# Altium project DashBoard.PrjPCB
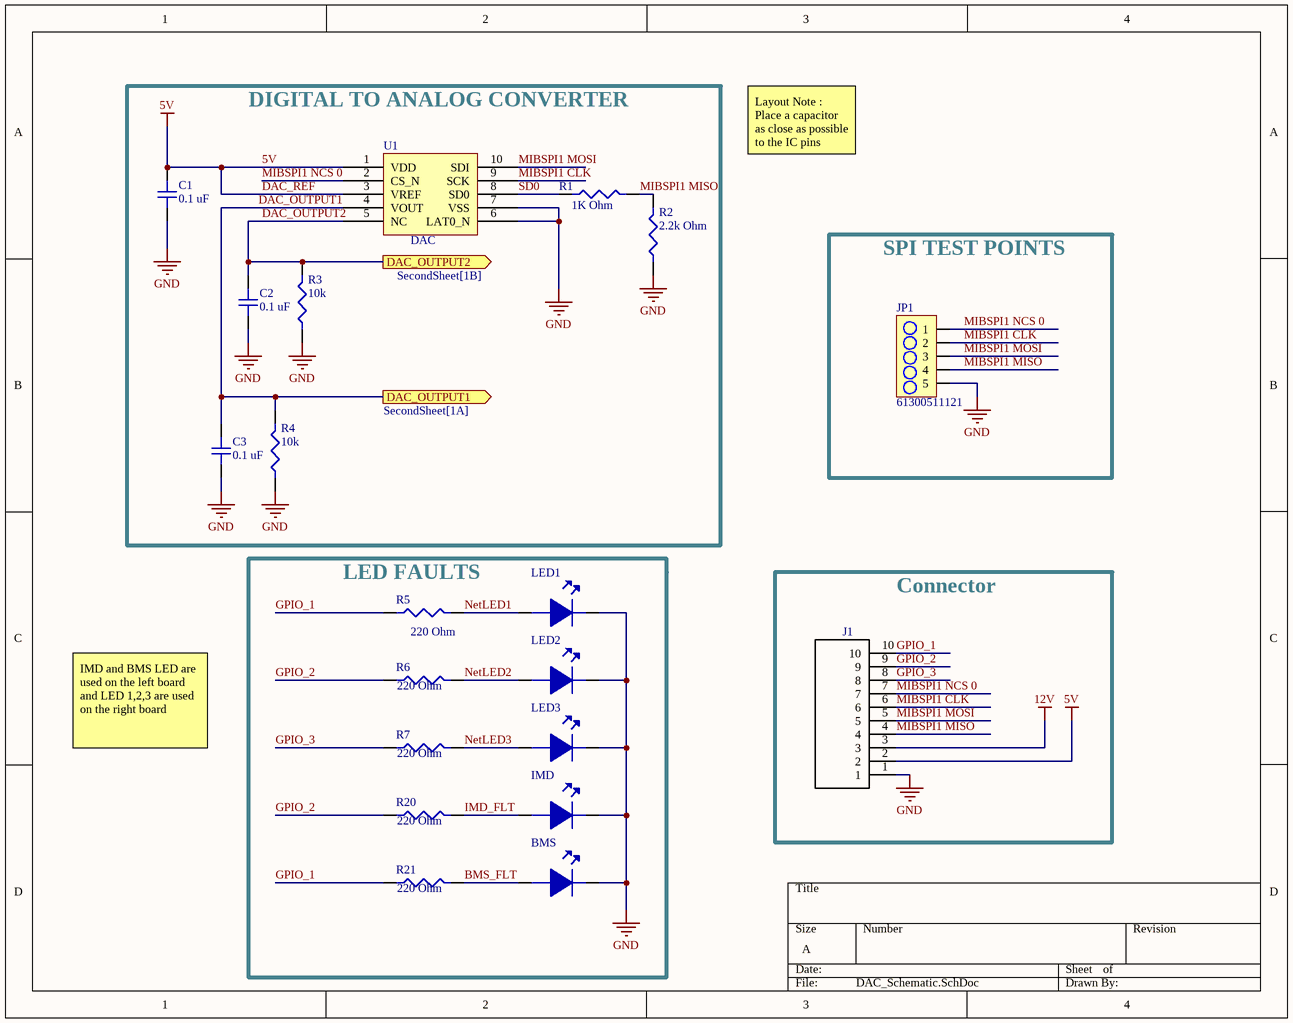
[diagram p0: DAC_Schematic.SchDoc]
2 sheets, 40 parts. Net scope: flat (ports and power ports of the same name join across sheets).
Board files: DashBoardLed.PcbDoc, DashBoardRight.PcbDoc
Sheets:
  DAC_Schematic.SchDoc
  SecondSheet.SchDoc

## Sheet DAC_Schematic.SchDoc
size A

### Parts
BMS  C503B-RAN-CZ0C0AA1  [Diode]  (value not drawn)
C1  0.1 uF  [CAPC1608X09N]
C2  0.1 uF  [CAPC1608X09N]
C3  0.1 uF  [CAPC1608X09N]
IMD  C503B-RAN-CZ0C0AA1  [Diode]  (value not drawn)
J1  103635-9  [*TE_103635-9]  (value not drawn)
JP1  61300511121  [5PIN_HEADER]
LED1  C503B-RAN-CZ0C0AA1  [Diode]  (value not drawn)
LED2  C503B-RAN-CZ0C0AA1  [Diode]  (value not drawn)
LED3  C503B-RAN-CZ0C0AA1  [Diode]  (value not drawn)
R1  1K Ohm  [RESC2012X06N]
R2  2.2k Ohm  [RESC2012X06N]
R3  10k  [RESC2012X06N]
R4  10k  [RESC2012X06N]
R5  220 Ohm  [RESC2012X06N]
R6  220 Ohm  [RESC2012X06N]
R7  220 Ohm  [RESC2012X06N]
R20  220 Ohm  [RESC2012X06N]
R21  220 Ohm  [RESC2012X06N]
U1  DAC  [TSSOP50P490X110-10N]

### Blocks framed on the sheet
DIGITAL TO ANALOG CONVERTER: C1-C3 R1-R4 U1
SPI TEST POINTS: JP1
LED FAULTS: BMS IMD LED1-LED3 R5-R7 R20 R21
Connector: J1

### Ports
DAC_OUTPUT1 (out, see SecondSheet[1A]), DAC_OUTPUT2 (out, see SecondSheet[1B])

### Nets
5V: C1.2 J1.2 U1.1(VDD) U1.3(VREF)  [also labelled DAC_REF]
12V: J1.3
GND: BMS.A C1.1 C2.1 C3.1 IMD.A J1.1 JP1.5 LED1.A LED2.A LED3.A R2.1 R3.1 R4.1 U1.6(LAT0_N) U1.7(VSS)
BMS_FLT: BMS.K R21.2
DAC_OUTPUT1: C3.2 R4.2 U1.4(VOUT) ; port DAC_OUTPUT1
DAC_OUTPUT2: C2.2 R3.2 U1.5(NC) ; port DAC_OUTPUT2
GPIO_1: J1.10 R5.1 R21.1
GPIO_2: J1.9 R6.1 R20.1
GPIO_3: J1.8 R7.1
IMD_FLT: IMD.K R20.2
MIBSPI1 CLK: J1.6 JP1.2 U1.9(SCK)
MIBSPI1 MISO: J1.4 JP1.4 R1.2 R2.2
MIBSPI1 MOSI: J1.5 JP1.3 U1.10(SDI)
MIBSPI1 NCS 0: J1.7 JP1.1 U1.2(CS_N)
NetLED1: LED1.K R5.2
NetLED2: LED2.K R6.2
NetLED3: LED3.K R7.2
SD0: R1.1 U1.8(SD0)

### Notes on the sheet
- Layout Note : Place a capacitor as close as possible to the IC pins
- IMD and BMS LED are used on the left board and LED 1,2,3 are used on the right board

### Library data of the parts
BMS IMD LED1-LED3 = C503B-RAN-CZ0C0AA1: LED Uni-Color Red 2-Pin T-1 3/4 Cardboard; Manufacturer: Cree; Lens Color: Colorless; Lens Style: Round,Domed; Lens Transparency: Clear; Luminous Intensity: 20550mcd; Forward Voltage: 2.1V; Test Current: 20mA; Viewing Angle: 15°; Dominant Wavelength: 624nm; Lens Size: 5mm; Supplier 1: Digi-Key; Manufacturer Part Number: C503B-RAN-CZ0C0AA1; Stock 1: 146433; Pricing 1: 1=0.15, 10=0.141, 100=0.1303, 1000=0.11653, 50000=0.10821 (USD); Mount: Through Hole; Case/Package: Radial; Color: Red; Packaging: Bulk; Height: 10.1mm; ComponentLink1URL: https://www.cree.com/led-components/media/documents/C503B-RAS-RAN-AAS-AAN-RBS-RBN-ABS-ABN-RCS-RCN-ACS-ACN-1079.pdf?src-supplier=Digi-Key; ComponentLink1Description: https://www.cree.com/led-components/media/documents/C503B-RAS-RAN-AAS-AAN-RBS-RBN-ABS-ABN-RCS-RCN-ACS-ACN-1079.pdf?src-supplier=Digi-Key; Supplier Part Number 1: C503B-RAN-CZ0C0AA1-ND
C1-C3 = C0603C104Z3VACTU: KEMET - C0603C104Z3VACTU - Multilayer Ceramic Capacitor, C Series, 0.1 - F, +80%, -20%, Y5V, 25 V, 0603 [1608 Metric] RoHS Compliant: Yes; Capacitance: 100nF; Tolerance: 80%; Voltage Rating: 25V; Dissipation Factor: 7%; Supplier 1: Digi-Key; Manufacturer: KEMET; Manufacturer Part Number: C0603C104Z3VACTU; Stock 1: 1377515; Pricing 1: 1=0.1, 10=0.032, 100=0.0143, 500=0.0102, 1000=0.00802 (USD); Mount: Surface Mount,PCB; Case/Package: 0603; Number of Pins: 2; Case Code (Metric): 1608; Case Code (Imperial): 0603; Dielectric Material: Ceramic; Min Operating Temperature: -30°C; Max Operating Temperature: 85°C; Packaging: Tape and Reel; Voltage Rating (DC): 25V; Package Quantity: 1; Dielectric: Y5V; Termination: SMD/SMT; Voltage: 25V; Length: 1.6mm; Height: 0.8mm; Width: 0.031inch; Thickness: 0.034inch; Lead Pitch: 0.7mm; Depth: 0.8mm; Radiation Hardening: No; REACH SVHC: No SVHC; Lead Free: Lead Free; ComponentLink1URL: http://www.farnell.com/datasheets/1470417.pdf?src-supplier=Element14; ComponentLink1Description: http://www.farnell.com/datasheets/1470417.pdf?src-supplier=Element14; ComponentLink2URL: http://www.farnell.com/datasheets/1828802.pdf?src-supplier=Element14; ComponentLink2Description: http://www.farnell.com/datasheets/1828802.pdf?src-supplier=Element14; ComponentLink3URL: http://www.alliedelec.com/m/d/9bfe7773041ffe9d406e68bc7b377fdd.pdf?src-supplier=Allied+Electronics; ComponentLink3Description: http://www.alliedelec.com/m/d/9bfe7773041ffe9d406e68bc7b377fdd.pdf?src-supplier=Allied+Electronics; Supplier Part Number 1: 399-1100-1-ND
J1 = 103635-9: 10 MTE HDR SRRA LATCH .100CL; Number_of_Positions: 10; Product_Type: Connector; Centerline_Pitch: 2.54 mm[.1 in]; MF: TE Connectivity; TE_purchase_URL: https://www.te.com/usa-en/product-103635-9.html?te_bu=Cor&te_type=disp&te_campaign=seda_glo_cor-seda-global-disp-prtnr-fy19-seda-model-bom-cta_sma-317_1&elqCampaignId=32493; Digi-Key_Purchase_URL: https://www.digikey.ca/product-detail/en/te-connectivity-amp-connectors/103635-9/A28643-ND/298697?utm_source=snapeda&utm_medium=aggregator&utm_campaign=symbol; MP: 103635-9; Package: None; SnapEDA_Link: https://www.snapeda.com/parts/103635-9/TE%20Connectivity/view-part/?ref=snap; Digi-Key_Part_Number: A28643-ND; EU_RoHS_Compliance: Not Compliant; Value: *
JP1 = 61300511121: WURTH ELEKTRONIK         61300511121            Board-To-Board Connector, Vertical, WR-PHD Series, Through Hole, Header, 5 Contacts, 2.54 mm; Manufacturer: Wurth Electronics; Number of Positions: 5; Gender: Male; Connector Type: Male Pin; Pitch: 0.1inch; Supplier 1: Digi-Key; Manufacturer Part Number: 61300511121; Stock 1: 28976; Pricing 1: 1=0.25, 10=0.209, 25=0.174, 50=0.145, 100=0.132, 1000=0.12 (USD); Mount: Through Hole; Contact Plating: Gold; Contact Material: Copper; Color: Black; Number of Rows: 1; Packaging: Bulk; Termination: Solder; Number of Contacts: 5; Contact Mating Length: 0.236inch; REACH SVHC: Unknown; Lead Free: Lead Free; ComponentLink1URL: https://katalog.we-online.de/em/datasheet/6130xx11121.pdf?src-supplier=Digi-Key; ComponentLink1Description: https://katalog.we-online.de/em/datasheet/6130xx11121.pdf?src-supplier=Digi-Key; ComponentLink2URL: http://www.farnell.com/cad/1737268.pdf?src-supplier=Element14; ComponentLink2Description: http://www.farnell.com/cad/1737268.pdf?src-supplier=Element14; Supplier Part Number 1: 732-5318-ND
R1 = RC0805JR-071KL: RES SMD 1K OHM 5% 1/8W 0805; Manufacturer: Yageo; Resistance: 1kR; Power Rating: 125mW; Voltage Rating: 150V; Temperature Coefficient: 100ppm/°C; Supplier 1: Digi-Key; Manufacturer Part Number: RC0805JR-071KL; Stock 1: 6376783; Pricing 1: 1=0.1, 10=0.032, 100=0.0132, 1000=0.00594, 2500=0.00515 (USD); Case/Package: 0805; Case Code (Imperial): 0805; Case Code (Metric): 2012; Contact Plating: Tin,Lead,Matte; Min Operating Temperature: -55°C; Max Operating Temperature: 155°C; Tolerance: 5%; Packaging: Tape and Reel; Termination: SMD/SMT; Composition: Thick Film; Military Standard: Not; Length: 2mm; Depth: 1.25mm; Radiation Hardening: No; REACH SVHC: Unknown; Lead Free: Lead Free; ComponentLink1URL: http://www.farnell.com/datasheets/2167052.pdf?src-supplier=Verical; ComponentLink1Description: http://www.farnell.com/datasheets/2167052.pdf?src-supplier=Verical; ComponentLink2URL: http://www.farnell.com/datasheets/2167052.pdf?src-supplier=Mouser; ComponentLink2Description: http://www.farnell.com/datasheets/2167052.pdf?src-supplier=Mouser; ComponentLink3URL: http://www.farnell.com/datasheets/2167052.pdf?src-supplier=Element14; ComponentLink3Description: http://www.farnell.com/datasheets/2167052.pdf?src-supplier=Element14; ComponentLink4URL: http://www.farnell.com/datasheets/444164.pdf?src-supplier=Element14; ComponentLink4Description: http://www.farnell.com/datasheets/444164.pdf?src-supplier=Element14; Supplier Part Number 1: 311-1.0KARDKR-ND
R2 = RC0805FR-072K2L: RES SMD 2.2K OHM 1% 1/8W 0805; Manufacturer: Yageo; Power Rating: 125mW; Resistance: 2.2kR; Temperature Coefficient: 100ppm/°C; Voltage Rating: 150V; Supplier 1: Digi-Key; Manufacturer Part Number: RC0805FR-072K2L; Stock 1: 4627797; Pricing 1: 1=0.1, 10=0.04, 100=0.0163, 1000=0.00731, 2500=0.00635 (USD); Case/Package: 0805; Number of Pins: 2; Case Code (Imperial): 0805; Case Code (Metric): 2012; Min Operating Temperature: -55°C; Max Operating Temperature: 155°C; Tolerance: 1%; Packaging: Tape and Reel; Voltage Rating (DC): 150V; Package Quantity: 1; Termination: SMD/SMT; Composition: Thick Film; Number of Terminations: 2; Max Power Dissipation: 125mW; Features: Moisture Resistant; Military Standard: Not; Length: 2mm; Height: 0.5mm; Width: 1.25mm; Depth: 1.25mm; Lead Pitch: 0.4mm; REACH SVHC: Unknown; Lead Free: Lead Free; ComponentLink1URL: http://www.farnell.com/datasheets/38627.pdf?src-supplier=Element14; ComponentLink1Description: http://www.farnell.com/datasheets/38627.pdf?src-supplier=Element14; ComponentLink2URL: http://www.farnell.com/datasheets/444164.pdf?src-supplier=Element14; ComponentLink2Description: http://www.farnell.com/datasheets/444164.pdf?src-supplier=Element14; ComponentLink3URL: http://www.yageo.com/documents/recent/PYu-RC_Group_51_RoHS_L_9.pdf?src-supplier=Digi-Key; ComponentLink3Description: http://www.yageo.com/documents/recent/PYu-RC_Group_51_RoHS_L_9.pdf?src-supplier=Digi-Key; ComponentLink4URL: http://www.yageo.com/documents/recent/PYu-RC_Group_51_RoHS_L_10.pdf?src-supplier=Digi-Key; ComponentLink4Description: http://www.yageo.com/documents/recent/PYu-RC_Group_51_RoHS_L_10.pdf?src-supplier=Digi-Key; Supplier Part Number 1: 311-2.20KCRCT-ND
R3 R4 = RNCP0805FTD10K0: RES 10K OHM 1% 1/4W 0805; Manufacturer: Stackpole Electronics; Resistance: 10kR; Max Power Dissipation: 250mW; Temperature Coefficient: 100ppm/°C; Supplier 1: Digi-Key; Manufacturer Part Number: RNCP0805FTD10K0; Stock 1: 277525; Pricing 1: 1=0.1, 10=0.072, 100=0.0277, 1000=0.0122, 2500=0.01053 (USD); Mount: Surface Mount; Case/Package: 0805; Case Code (Metric): 2012; Case Code (Imperial): 0805; Min Operating Temperature: -55°C; Max Operating Temperature: 155°C; Tolerance: 1%; Packaging: Tape and Reel; Composition: Thin Film; Number of Terminations: 2; Features: Moisture Resistant,Anti-Sulfur; Length: 0.079inch; Height: 0.024inch; Width: 0.049inch; Lead Free: Lead Free; ComponentLink1URL: https://www.seielect.com/catalog/SEI-Packaging.pdf?src-supplier=Digi-Key; ComponentLink1Description: https://www.seielect.com/catalog/SEI-Packaging.pdf?src-supplier=Digi-Key; Supplier Part Number 1: RNCP0805FTD10K0CT-ND
R5-R7 R20 R21 = CRGCQ0805F220R: TE CONNECTIVITY - CRGCQ0805F220R - RES, 220R, 1%, 0805, THICK FILM; Supplier 1: Digi-Key; Manufacturer: TE Connectivity; Manufacturer Part Number: CRGCQ0805F220R; Stock 1: 73679; Pricing 1: 1=0.1, 10=0.048, 100=0.0196, 1000=0.00882, 2500=0.00766 (USD); ComponentLink1URL: https://4donline.ihs.com/images/VipMasterIC/IC/TYEL/TYEL-S-A0004929575/TYEL-S-A0004929575-1.pdf?hkey=52A5661711E402568146F3353EA87419&src-supplier=Farnell; ComponentLink1Description: https://4donline.ihs.com/images/VipMasterIC/IC/TYEL/TYEL-S-A0004929575/TYEL-S-A0004929575-1.pdf?hkey=52A5661711E402568146F3353EA87419&src-supplier=Farnell; ComponentLink2URL: https://www.te.com/commerce/DocumentDelivery/DDEController?Action=srchrtrv&amp;DocNm=1773204-3&amp;DocType=DS&amp;DocLang=English&src-supplier=Digi-Key; ComponentLink2Description: https://www.te.com/commerce/DocumentDelivery/DDEController?Action=srchrtrv&amp;DocNm=1773204-3&amp;DocType=DS&amp;DocLang=English&src-supplier=Digi-Key; Supplier Part Number 1: A129741CT-ND
U1 = MCP48FVB02-E/UN: MICROCHIP - MCP48FVB02-E/UN - DAC, 8BIT, DUAL, MSOP-10; Number of Bits: 8; Number of D/A Converters: 2; Settling Time: 7.8us; Differential Output: No; Interface: SPI; Resolution: 8b; Supplier 1: Digi-Key; Manufacturer: Microchip; Manufacturer Part Number: MCP48FVB02-E/UN; Stock 1: 135; Pricing 1: 1=1.16, 25=0.97, 100=0.88 (USD); Case/Package: MSOP; Number of Pins: 10; Min Operating Temperature: -40°C; Max Operating Temperature: 125°C; Packaging: Rail/Tube; REACH SVHC: No SVHC; ComponentLink1URL: http://www.farnell.com/datasheets/2002391.pdf?src-supplier=Element14; ComponentLink1Description: http://www.farnell.com/datasheets/2002391.pdf?src-supplier=Element14; ComponentLink2URL: http://www.farnell.com/datasheets/2002391.pdf?src-supplier=Farnell; ComponentLink2Description: http://www.farnell.com/datasheets/2002391.pdf?src-supplier=Farnell; ComponentLink3URL: http://www.microchip.com/mymicrochip/filehandler.aspx?ddocname=en576860&src-supplier=Digi-Key; ComponentLink3Description: http://www.microchip.com/mymicrochip/filehandler.aspx?ddocname=en576860&src-supplier=Digi-Key; Supplier Part Number 1: MCP48FVB02-E/UN-ND

## Sheet SecondSheet.SchDoc
size A
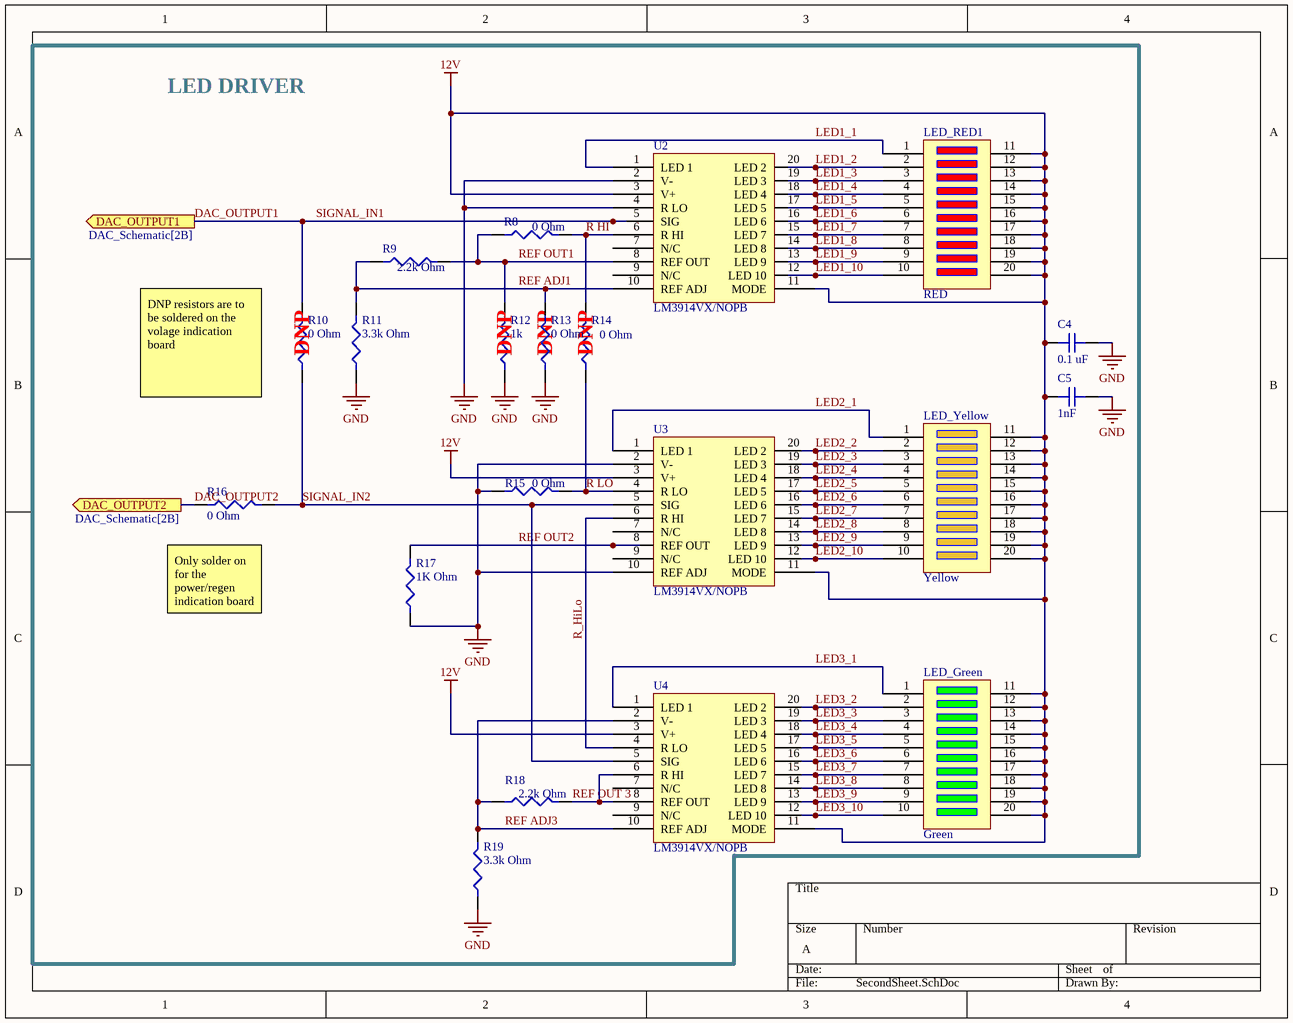
[diagram p1: SecondSheet.SchDoc]

### Parts
C4  0.1 uF  [CAPC1608X09N]
C5  1nF  [CAPC1608X09N]
LED_Green  Green  [DIP20]
LED_RED1  RED  [DIP20]
LED_Yellow  Yellow  [DIP20]
R8  0 Ohm  [RESC2012X06N]
R9  2.2k Ohm  [RESC2012X06N]
R10  0 Ohm  [RESC2012X06N]
R11  3.3k Ohm  [RESC2012X06N]
R12  1k  [RESC2012X06N]
R13  0 Ohm  [RESC2012X06N]
R14  0 Ohm  [RESC2012X06N]
R15  0 Ohm  [RESC2012X06N]
R16  0 Ohm  [RESC2012X06N]
R17  1K Ohm  [RESC2012X06N]
R18  2.2k Ohm  [RESC2012X06N]
R19  3.3k Ohm  [RESC2012X06N]
U2  LM3914VX/NOPB  [PLCC127P990X990X457-20N]
U3  LM3914VX/NOPB  [PLCC127P990X990X457-20N]
U4  LM3914VX/NOPB  [PLCC127P990X990X457-20N]

### Ports
DAC_OUTPUT1 (out, see DAC_Schematic[2B]), DAC_OUTPUT2 (out, see DAC_Schematic[2B])

### Nets
12V: C4.1 C5.1 LED_Green.11 LED_Green.12 LED_Green.13 LED_Green.14 LED_Green.15 LED_Green.16 LED_Green.17 LED_Green.18 LED_Green.19 LED_Green.20 LED_RED1.11 LED_RED1.12 LED_RED1.13 LED_RED1.14 LED_RED1.15 LED_RED1.16 LED_RED1.17 LED_RED1.18 LED_RED1.19 LED_RED1.20 LED_Yellow.11 LED_Yellow.12 LED_Yellow.13 LED_Yellow.14 LED_Yellow.15 LED_Yellow.16 LED_Yellow.17 LED_Yellow.18 LED_Yellow.19 LED_Yellow.20 U2.3(V+) U2.11(MODE) U3.3(V+) U3.11(MODE) U4.3(V+) U4.11(MODE)
GND: C4.2 C5.2 R11.1 R12.1 R13.1 R15.1 R17.1 R19.1 U2.2(V-) U2.4(R_LO) U3.2(V-) U3.10(REF_ADJ)
DAC_OUTPUT1: R10.2 U2.5(SIG) ; port DAC_OUTPUT1  [also labelled SIGNAL_IN1]
DAC_OUTPUT2: R16.1 ; port DAC_OUTPUT2
LED1_1: LED_RED1.1 U2.1(LED_1)
LED1_2: LED_RED1.2 U2.20(LED_2)
LED1_3: LED_RED1.3 U2.19(LED_3)
LED1_4: LED_RED1.4 U2.18(LED_4)
LED1_5: LED_RED1.5 U2.17(LED_5)
LED1_6: LED_RED1.6 U2.16(LED_6)
LED1_7: LED_RED1.7 U2.15(LED_7)
LED1_8: LED_RED1.8 U2.14(LED_8)
LED1_9: LED_RED1.9 U2.13(LED_9)
LED1_10: LED_RED1.10 U2.12(LED_10)
LED2_1: LED_Yellow.1 U3.1(LED_1)
LED2_2: LED_Yellow.2 U3.20(LED_2)
LED2_3: LED_Yellow.3 U3.19(LED_3)
LED2_4: LED_Yellow.4 U3.18(LED_4)
LED2_5: LED_Yellow.5 U3.17(LED_5)
LED2_6: LED_Yellow.6 U3.16(LED_6)
LED2_7: LED_Yellow.7 U3.15(LED_7)
LED2_8: LED_Yellow.8 U3.14(LED_8)
LED2_9: LED_Yellow.9 U3.13(LED_9)
LED2_10: LED_Yellow.10 U3.12(LED_10)
LED3_1: LED_Green.1 U4.1(LED_1)
LED3_2: LED_Green.2 U4.20(LED_2)
LED3_3: LED_Green.3 U4.19(LED_3)
LED3_4: LED_Green.4 U4.18(LED_4)
LED3_5: LED_Green.5 U4.17(LED_5)
LED3_6: LED_Green.6 U4.16(LED_6)
LED3_7: LED_Green.7 U4.15(LED_7)
LED3_8: LED_Green.8 U4.14(LED_8)
LED3_9: LED_Green.9 U4.13(LED_9)
LED3_10: LED_Green.10 U4.12(LED_10)
R HI: R8.2 R14.2 U2.6(R_HI)
R LO: R14.1 R15.2 U3.4(R_LO)
R_HiLo: U3.6(R_HI) U4.4(R_LO)
REF ADJ1: R9.1 R11.2 R13.2 U2.10(REF_ADJ)
REF ADJ3: R18.1 R19.2 U4.2(V-) U4.10(REF_ADJ)
REF OUT1: R8.1 R9.2 R12.2 U2.8(REF_OUT)
REF OUT2: R17.2 U3.8(REF_OUT)
REF OUT 3: R18.2 U4.6(R_HI) U4.8(REF_OUT)
SIGNAL_IN2: R10.1 R16.2 U3.5(SIG) U4.5(SIG)

Not connected (* = marked no-connect by the designer): U2 7(N/C) 9(N/C); U3 7(N/C) 9(N/C); U4 7(N/C) 9(N/C)

### Notes on the sheet
- LED DRIVER
- (near R10) DNP
- (near R12) DNP
- (near R13) DNP
- (near R14) DNP
- (near R10) DNP resistors are to be soldered on the volage indication board
- (near R16) Only solder on for the power/regen indication board

### Library data of the parts
C4 = C0603C104Z3VACTU: as C1 on sheet DAC_Schematic; Supplier 1: Digi-Key; Manufacturer: KEMET; Manufacturer Part Number: C0603C104Z3VACTU; Stock 1: 1377515; Pricing 1: 1=0.1, 10=0.032, 100=0.0143, 500=0.0102, 1000=0.00802 (USD); Mount: Surface Mount,PCB; Case/Package: 0603; Number of Pins: 2; Case Code (Metric): 1608; Case Code (Imperial): 0603; Dielectric Material: Ceramic; Min Operating Temperature: -30°C; Max Operating Temperature: 85°C; Packaging: Tape and Reel; Voltage Rating (DC): 25V; Package Quantity: 1; Dielectric: Y5V; Termination: SMD/SMT; Voltage: 25V; Length: 1.6mm; Height: 0.8mm; Width: 0.031inch; Thickness: 0.034inch; Lead Pitch: 0.7mm; Depth: 0.8mm; Radiation Hardening: No; REACH SVHC: No SVHC; Lead Free: Lead Free; ComponentLink1URL: http://www.farnell.com/datasheets/1470417.pdf?src-supplier=Element14; ComponentLink1Description: http://www.farnell.com/datasheets/1470417.pdf?src-supplier=Element14; ComponentLink2URL: http://www.farnell.com/datasheets/1828802.pdf?src-supplier=Element14; ComponentLink2Description: http://www.farnell.com/datasheets/1828802.pdf?src-supplier=Element14; ComponentLink3URL: http://www.alliedelec.com/m/d/9bfe7773041ffe9d406e68bc7b377fdd.pdf?src-supplier=Allied+Electronics; ComponentLink3Description: http://www.alliedelec.com/m/d/9bfe7773041ffe9d406e68bc7b377fdd.pdf?src-supplier=Allied+Electronics; Supplier Part Number 1: 399-1100-1-ND
C5 = CC0603KRX7R9BB102: CAP CER 1000PF 50V X7R 0603; Manufacturer: Yageo; Material: Ceramic; Tolerance: 10%; Insulation Resistance: 100GR; Supplier 1: Digi-Key; Manufacturer Part Number: CC0603KRX7R9BB102; Stock 1: 5143484; Pricing 1: 1=0.1, 10=0.04, 100=0.018, 500=0.01284, 1000=0.01009 (USD); Mount: Surface Mount; Case/Package: 0603; Number of Pins: 2; Case Code (Metric): 1608; Case Code (Imperial): 0603; Min Operating Temperature: -55°C; Max Operating Temperature: 125°C; Package Quantity: 1; Capacitance: 1nF; Voltage Rating: 50V; Packaging: Tape and Reel; Voltage Rating (DC): 50V; Dielectric: X7R; Termination: SMD/SMT; Composition: Ceramic; Voltage: 50V; Length: 1.6mm; Height: 0.8mm; Width: 0.031inch; Thickness: 0.035inch; Depth: 0.8mm; Radiation Hardening: No; REACH SVHC: No SVHC; Lead Free: Lead Free; Halogen Free: Halogen Free; ComponentLink1URL: http://www.yageo.com/documents/recent/UPY-GPHC_X7R_6.3V-to-50V_18.pdf?src-supplier=Digi-Key; ComponentLink1Description: http://www.yageo.com/documents/recent/UPY-GPHC_X7R_6.3V-to-50V_18.pdf?src-supplier=Digi-Key; ComponentLink2URL: http://www.yageo.com/documents/recent/UPY-GPHC_X7R_6.3V-to-50V_8.pdf?src-supplier=Avnet+Europe; ComponentLink2Description: http://www.yageo.com/documents/recent/UPY-GPHC_X7R_6.3V-to-50V_8.pdf?src-supplier=Avnet+Europe; ComponentLink3URL: https://www.verical.com/server-webapp/html/getDatasheet?partID=251790&src-supplier=Verical; ComponentLink3Description: https://www.verical.com/server-webapp/html/getDatasheet?partID=251790&src-supplier=Verical; ComponentLink4URL: http://www.farnell.com/datasheets/2167236.pdf?src-supplier=Element14; ComponentLink4Description: http://www.farnell.com/datasheets/2167236.pdf?src-supplier=Element14; ComponentLink5URL: https://produktinfo.conrad.com/datenblaetter/425000-449999/445532-da-01-en-KERKO_CHIP_0603_NP0_1000PF.pdf?src-supplier=Conrad; ComponentLink5Description: https://produktinfo.conrad.com/datenblaetter/425000-449999/445532-da-01-en-KERKO_CHIP_0603_NP0_1000PF.pdf?src-supplier=Conrad; Supplier Part Number 1: 311-1080-1-ND
LED_Green = LTA-1000G: LED BAR GRAPH 10-SEGMENT GREEN; Manufacturer: Vishay Lite-On; Shape: Rectangular; Luminous Intensity: 2mcd; Forward Current: 25mA; Forward Voltage: 2.6V; Lens Style: Tinted,Diffused,Rectangular; Voltage Rating: 2.1V; Power Rating: 75mW; Test Current: 10mA; Dominant Wavelength: 569nm; Number of Elements: 10; Wavelength: 565nm; Reverse Voltage: 5V; Supplier 1: Digi-Key; Manufacturer Part Number: LTA-1000G; Stock 1: 7635; Pricing 1: 1=1.4, 10=1.138, 100=0.7, 500=0.595, 1000=0.49, 2500=0.4655, 5000=0.455, 10000=0.4445 (USD); Mount: Through Hole; Case/Package: PDIP; Number of Pins: 20; Color: Green; Number of Terminals: 20; Min Operating Temperature: -35°C; Max Operating Temperature: 85°C; Package Quantity: 20; Packaging: Rail/Tube; Illumination Color: Green; Current: 25mA; Power Dissipation: 75mW; Number of LEDs: 10; Length: 25.27mm; Width: 10.2mm; Depth: 10.16mm; Radiation Hardening: No; Lead Free: Lead Free; ComponentLink1URL: http://optoelectronics.liteon.com/upload/download/DS-30-92-0809/A1000G.pdf?src-supplier=Digi-Key; ComponentLink1Description: http://optoelectronics.liteon.com/upload/download/DS-30-92-0809/A1000G.pdf?src-supplier=Digi-Key; ComponentLink2URL: http://www1.futureelectronics.com/doc/LITE-ON/LITE-ON%20LTA-1000G.pdf?src-supplier=Future+Electronics; ComponentLink2Description: http://www1.futureelectronics.com/doc/LITE-ON/LITE-ON%20LTA-1000G.pdf?src-supplier=Future+Electronics; ComponentLink3URL: http://www.jameco.com/Jameco/Products/ProdDS/697469.pdf?src-supplier=Jameco; ComponentLink3Description: http://www.jameco.com/Jameco/Products/ProdDS/697469.pdf?src-supplier=Jameco; ComponentLink4URL: https://www.verical.com/server-webapp/html/getDatasheet?partID=103036&src-supplier=Verical; ComponentLink4Description: https://www.verical.com/server-webapp/html/getDatasheet?partID=103036&src-supplier=Verical; ComponentLink5URL: http://www.mouser.com/ds/2/239/S_110_A1000G-369759.pdf?src-supplier=Mouser; ComponentLink5Description: http://www.mouser.com/ds/2/239/S_110_A1000G-369759.pdf?src-supplier=Mouser; Supplier Part Number 1: 160-1067-ND
LED_RED1 = LTA-1000HR: LED BAR GRAPH 10-SEGMENT RED; Manufacturer: Vishay Lite-On; Shape: Rectangular; Current: 25mA; Forward Voltage: 2.6V; Test Current: 10mA; Voltage Rating: 2V; Luminous Intensity: 2mcd; Lens Style: Tinted,Diffused,Rectangular; Power Rating: 75mW; Dominant Wavelength: 623nm; Number of Elements: 10; Wavelength: 635nm; Reverse Voltage: 5V; Supplier 1: Digi-Key; Manufacturer Part Number: LTA-1000HR; Stock 1: 21663; Pricing 1: 1=1.4, 10=1.138, 100=0.7, 500=0.595, 1000=0.49, 2500=0.4655, 5000=0.455, 10000=0.4445 (USD); Mount: Through Hole; Case/Package: PDIP; Number of Pins: 20; Color: Red; Number of Terminals: 20; Min Operating Temperature: -35°C; Max Operating Temperature: 85°C; Package Quantity: 20; Packaging: Rail/Tube; Forward Current: 25mA; Illumination Color: Red; Power Dissipation: 75mW; Number of LEDs: 10; Length: 25.27mm; Width: 10.2mm; Depth: 10.16mm; Radiation Hardening: No; Lead Free: Lead Free; ComponentLink1URL: http://optoelectronics.liteon.com/upload/download/DS-30-92-0810/LTA-1000HR.pdf?src-supplier=Digi-Key; ComponentLink1Description: http://optoelectronics.liteon.com/upload/download/DS-30-92-0810/LTA-1000HR.pdf?src-supplier=Digi-Key; ComponentLink2URL: http://www.jameco.com/Jameco/Products/ProdDS/697477.pdf?src-supplier=Jameco; ComponentLink2Description: http://www.jameco.com/Jameco/Products/ProdDS/697477.pdf?src-supplier=Jameco; ComponentLink3URL: http://www.mouser.com/ds/2/239/S_110_LTA-1000HR-369780.pdf?src-supplier=Mouser; ComponentLink3Description: http://www.mouser.com/ds/2/239/S_110_LTA-1000HR-369780.pdf?src-supplier=Mouser; ComponentLink4URL: http://www.onlinecomponents.com/productFiles/mf-LI/2s_110_lta-1000hr.pdf?src-supplier=Onlinecomponents.com; ComponentLink4Description: http://www.onlinecomponents.com/productFiles/mf-LI/2s_110_lta-1000hr.pdf?src-supplier=Onlinecomponents.com; Supplier Part Number 1: 160-1066-ND
LED_Yellow = LTA-1000Y: LED BAR GRAPH 10-SEGMENT YELLOW; Manufacturer: Vishay Lite-On; Max Power Dissipation: 60mW; Voltage Rating: 2.1V; Forward Current: 20mA; Wavelength: 588nm; Luminous Intensity: 2mcd; Forward Voltage: 2.6V; Lens Style: Tinted,Rectangular; Number of Elements: 10; Reverse Voltage: 5V; Supplier 1: Digi-Key; Manufacturer Part Number: LTA-1000Y; Stock 1: 446; Pricing 1: 1=1.4, 10=1.138, 100=0.7, 500=0.595, 1000=0.49, 2500=0.4655, 5000=0.455, 10000=0.4445 (USD); Mount: Through Hole; Case/Package: PDIP; Number of Pins: 20; Color: Yellow; Min Operating Temperature: -35°C; Max Operating Temperature: 85°C; Package Quantity: 20; Packaging: Rail/Tube; Power Rating: 60mW; Illumination Color: Yellow; Current: 20mA; Dominant Wavelength: 588nm; Power Dissipation: 60mW; Test Current: 20mA; Number of LEDs: 10; Length: 25.27mm; Width: 10.16mm; Depth: 10.16mm; Radiation Hardening: No; Lead Free: Lead Free; ComponentLink1URL: https://media.digikey.com/pdf/Data%20Sheets/Lite-On%20PDFs/LTA-1000Y.pdf?src-supplier=Digi-Key; ComponentLink1Description: https://media.digikey.com/pdf/Data%20Sheets/Lite-On%20PDFs/LTA-1000Y.pdf?src-supplier=Digi-Key; ComponentLink2URL: http://www.mouser.com/ds/2/239/_100_A1000Y-61118.pdf?src-supplier=Mouser; ComponentLink2Description: http://www.mouser.com/ds/2/239/_100_A1000Y-61118.pdf?src-supplier=Mouser; ComponentLink3URL: https://www.verical.com/server-webapp/html/getDatasheet?partID=145555&src-supplier=Verical; ComponentLink3Description: https://www.verical.com/server-webapp/html/getDatasheet?partID=145555&src-supplier=Verical; Supplier Part Number 1: 160-1068-ND
R8 R10 R12-R16 = RMCF0805ZT0R00: RES 0 OHM JUMPER 1/8W 0805; Manufacturer: Stackpole Electronics; Resistance: 0mR; Power Rating: 125mW; Supplier 1: Digi-Key; Manufacturer Part Number: RMCF0805ZT0R00; Stock 1: 1111413; Pricing 1: 1=0.1, 10=0.021, 25=0.0152, 50=0.0116, 100=0.0086, 250=0.00652, 500=0.00522, 1000=0.00385 (USD); Mount: Surface Mount; Case/Package: 0805; Case Code (Metric): 2012; Case Code (Imperial): 0805; Contact Plating: Tin,Matte; Min Operating Temperature: -55°C; Max Operating Temperature: 155°C; Packaging: Tape and Reel; Composition: Thick Film; Number of Terminations: 2; Military Standard: Not; Max Power Dissipation: 125mW; Features: Automotive AEC-Q200; Length: 2mm; Height: 0.026inch; Width: 0.049inch; Depth: 1.25mm; Radiation Hardening: No; Lead Free: Lead Free; ComponentLink1URL: https://www.verical.com/server-webapp/html/getDatasheet?partID=360417&src-supplier=Verical; ComponentLink1Description: https://www.verical.com/server-webapp/html/getDatasheet?partID=360417&src-supplier=Verical; Supplier Part Number 1: RMCF0805ZT0R00DKR-ND
R9 R18 = RC0805FR-072K2L: as R2 on sheet DAC_Schematic; Supplier 1: Digi-Key; Manufacturer Part Number: RC0805FR-072K2L; Stock 1: 4627797; Pricing 1: 1=0.1, 10=0.04, 100=0.0163, 1000=0.00731, 2500=0.00635 (USD); Case/Package: 0805; Number of Pins: 2; Case Code (Imperial): 0805; Case Code (Metric): 2012; Min Operating Temperature: -55°C; Max Operating Temperature: 155°C; Tolerance: 1%; Packaging: Tape and Reel; Voltage Rating (DC): 150V; Package Quantity: 1; Termination: SMD/SMT; Composition: Thick Film; Number of Terminations: 2; Max Power Dissipation: 125mW; Features: Moisture Resistant; Military Standard: Not; Length: 2mm; Height: 0.5mm; Width: 1.25mm; Depth: 1.25mm; Lead Pitch: 0.4mm; REACH SVHC: Unknown; Lead Free: Lead Free; ComponentLink1URL: http://www.farnell.com/datasheets/38627.pdf?src-supplier=Element14; ComponentLink1Description: http://www.farnell.com/datasheets/38627.pdf?src-supplier=Element14; ComponentLink2URL: http://www.farnell.com/datasheets/444164.pdf?src-supplier=Element14; ComponentLink2Description: http://www.farnell.com/datasheets/444164.pdf?src-supplier=Element14; ComponentLink3URL: http://www.yageo.com/documents/recent/PYu-RC_Group_51_RoHS_L_9.pdf?src-supplier=Digi-Key; ComponentLink3Description: http://www.yageo.com/documents/recent/PYu-RC_Group_51_RoHS_L_9.pdf?src-supplier=Digi-Key; ComponentLink4URL: http://www.yageo.com/documents/recent/PYu-RC_Group_51_RoHS_L_10.pdf?src-supplier=Digi-Key; ComponentLink4Description: http://www.yageo.com/documents/recent/PYu-RC_Group_51_RoHS_L_10.pdf?src-supplier=Digi-Key; Supplier Part Number 1: 311-2.20KCRCT-ND
R11 R19 = ERA-6AEB332V: Thin Film Resistors - SMD 0805 1/8W 3.3Kohms; Manufacturer: Panasonic; Tolerance: 0.1%; Power Rating: 125mW; Voltage Rating: 100V; Resistance: 3.3kR; Temperature Coefficient: 25ppm/°C; Supplier 1: Digi-Key; Manufacturer Part Number: ERA-6AEB332V; Stock 1: 81370; Pricing 1: 1=0.36, 10=0.302, 100=0.1182, 1000=0.04948, 2500=0.04536 (USD); Mount: Surface Mount; Case/Package: 0805; Number of Pins: 2; Case Code (Metric): 2012; Case Code (Imperial): 0805; Contact Plating: Tin; Min Operating Temperature: -55°C; Max Operating Temperature: 155°C; Packaging: Tape and Reel; Package Quantity: 1; Composition: Thin Film,Metal Film; Number of Terminations: 2; Termination: SMD/SMT; Military Standard: Not; Max Power Dissipation: 125mW; Voltage Rating (DC): 100V; Features: Automotive AEC-Q200; Length: 2mm; Height: 0.5mm; Width: 1.25mm; Depth: 1.25mm; Radiation Hardening: No; REACH SVHC: No SVHC; Lead Free: Lead Free; ComponentLink1URL: http://www.farnell.com/datasheets/485442.pdf?src-supplier=Farnell; ComponentLink1Description: http://www.farnell.com/datasheets/485442.pdf?src-supplier=Farnell; ComponentLink2URL: http://uk.rs-online.com/webdocs/0bee/0900766b80beefcc.pdf?src-supplier=RSComponents; ComponentLink2Description: http://uk.rs-online.com/webdocs/0bee/0900766b80beefcc.pdf?src-supplier=RSComponents; ComponentLink3URL: http://industrial.panasonic.com/www-data/pdf/AOA0000/AOA0000CE26.pdf?src-supplier=Future+Electronics; ComponentLink3Description: http://industrial.panasonic.com/www-data/pdf/AOA0000/AOA0000CE26.pdf?src-supplier=Future+Electronics; ComponentLink4URL: https://www.alliedelec.com/m/d/b6b0537e86f421aa7f5975bb1d8f429a.pdf?src-supplier=Allied+Electronics; ComponentLink4Description: https://www.alliedelec.com/m/d/b6b0537e86f421aa7f5975bb1d8f429a.pdf?src-supplier=Allied+Electronics; ComponentLink5URL: http://industrial.panasonic.com/www-data/pdf/AOA0000/AOA0000CE26.pdf?src-supplier=Avnet; ComponentLink5Description: http://industrial.panasonic.com/www-data/pdf/AOA0000/AOA0000CE26.pdf?src-supplier=Avnet; ComponentLink6URL: http://industrial.panasonic.com/www-data/pdf/AOA0000/AOA0000CE26.pdf?src-supplier=Avnet+Europe; ComponentLink6Description: http://industrial.panasonic.com/www-data/pdf/AOA0000/AOA0000CE26.pdf?src-supplier=Avnet+Europe; ComponentLink7URL: http://industrial.panasonic.com/cdbs/www-data/pdf/RDM0000/AOA0000C307.pdf?src-supplier=Farnell; ComponentLink7Description: http://industrial.panasonic.com/cdbs/www-data/pdf/RDM0000/AOA0000C307.pdf?src-supplier=Farnell; ComponentLink8URL: https://www.distrelec.biz/Web/Downloads/_t/ds/ERA_eng_tds.pdf?mime=application%2Fpdf&src-supplier=Distrelec; ComponentLink8Description: https://www.distrelec.biz/Web/Downloads/_t/ds/ERA_eng_tds.pdf?mime=application%2Fpdf&src-supplier=Distrelec; ComponentLink9URL: http://www.farnell.com/datasheets/485442.pdf?src-supplier=Element14; ComponentLink9Description: http://www.farnell.com/datasheets/485442.pdf?src-supplier=Element14; ComponentLink10URL: http://www.farnell.com/datasheets/2052875.pdf?src-supplier=Farnell; ComponentLink10Description: http://www.farnell.com/datasheets/2052875.pdf?src-supplier=Farnell; ComponentLink11URL: http://www.farnell.com/datasheets/2059650.pdf?src-supplier=Farnell; ComponentLink11Description: http://www.farnell.com/datasheets/2059650.pdf?src-supplier=Farnell; ComponentLink12URL: https://produktinfo.conrad.com/datenblaetter/450000-474999/453184-da-01-en-WIDERSTAND_0805_ERA.pdf?src-supplier=Conrad; ComponentLink12Description: https://produktinfo.conrad.com/datenblaetter/450000-474999/453184-da-01-en-WIDERSTAND_0805_ERA.pdf?src-supplier=Conrad; Supplier Part Number 1: P3.3KDADKR-ND
R17 = RC0805JR-071KL: as R1 on sheet DAC_Schematic; Supplier 1: Digi-Key; Manufacturer Part Number: RC0805JR-071KL; Stock 1: 6376783; Pricing 1: 1=0.1, 10=0.032, 100=0.0132, 1000=0.00594, 2500=0.00515 (USD); Case/Package: 0805; Case Code (Imperial): 0805; Case Code (Metric): 2012; Contact Plating: Tin,Lead,Matte; Min Operating Temperature: -55°C; Max Operating Temperature: 155°C; Tolerance: 5%; Packaging: Tape and Reel; Termination: SMD/SMT; Composition: Thick Film; Military Standard: Not; Length: 2mm; Depth: 1.25mm; Radiation Hardening: No; REACH SVHC: Unknown; Lead Free: Lead Free; ComponentLink1URL: http://www.farnell.com/datasheets/2167052.pdf?src-supplier=Verical; ComponentLink1Description: http://www.farnell.com/datasheets/2167052.pdf?src-supplier=Verical; ComponentLink2URL: http://www.farnell.com/datasheets/2167052.pdf?src-supplier=Mouser; ComponentLink2Description: http://www.farnell.com/datasheets/2167052.pdf?src-supplier=Mouser; ComponentLink3URL: http://www.farnell.com/datasheets/2167052.pdf?src-supplier=Element14; ComponentLink3Description: http://www.farnell.com/datasheets/2167052.pdf?src-supplier=Element14; ComponentLink4URL: http://www.farnell.com/datasheets/444164.pdf?src-supplier=Element14; ComponentLink4Description: http://www.farnell.com/datasheets/444164.pdf?src-supplier=Element14; Supplier Part Number 1: 311-1.0KARDKR-ND
U2-U4 = LM3914VX/NOPB: LED DRVR 10Segment 20-Pin PLCC T/R; Manufacturer: TI National Semiconductor; Nominal Supply Current: 9.2mA; Max Supply Voltage: 25V; Max Power Dissipation: 1.365W; Output Current: 30mA; Number of Outputs: 10; Display Type: LCD; Supplier 1: Digi-Key; Manufacturer Part Number: LM3914VX/NOPB; Stock 1: 238; Pricing 1: 1=3.82, 10=3.43, 100=2.8099, 500=2.39202 (USD); Mount: Surface Mount; Case/Package: PLCC; Number of Pins: 20; Min Operating Temperature: 0°C; Max Operating Temperature: 70°C; Packaging: Tape and Reel; Package Quantity: 1000; Max Supply Current: 9.2mA; Power Dissipation: 1.365W; Number of Segments: 10; Number of Channels: 10; Width: 8.89mm; Radiation Hardening: No; Lead Free: Lead Free; ComponentLink1URL: http://www.ti.com/general/docs/lit/getliterature.tsp?genericPartNumber=LM3914&&fileType=pdf&src-supplier=Avnet; ComponentLink1Description: http://www.ti.com/general/docs/lit/getliterature.tsp?genericPartNumber=LM3914&&fileType=pdf&src-supplier=Avnet; ComponentLink2URL: http://www.jameco.com/Jameco/Products/ProdDS/1282476.pdf?src-supplier=Jameco; ComponentLink2Description: http://www.jameco.com/Jameco/Products/ProdDS/1282476.pdf?src-supplier=Jameco; ComponentLink3URL: http://www.ti.com/lit/ds/symlink/lm3914.pdf?src-supplier=Digi-Key; ComponentLink3Description: http://www.ti.com/lit/ds/symlink/lm3914.pdf?src-supplier=Digi-Key; ComponentLink4URL: https://www.verical.com/server-webapp/html/getDatasheet?partID=632645&src-supplier=Verical; ComponentLink4Description: https://www.verical.com/server-webapp/html/getDatasheet?partID=632645&src-supplier=Verical; Supplier Part Number 1: LM3914VX/NOPBDKR-ND

## Nets that join several sheets
12V: DAC_Schematic (J1.3), SecondSheet (38 pins)
GND: DAC_Schematic (15 pins), SecondSheet (12 pins)
DAC_OUTPUT1: DAC_Schematic (C3.2 R4.2 U1.4), SecondSheet (R10.2 U2.5)
DAC_OUTPUT2: DAC_Schematic (C2.2 R3.2 U1.5), SecondSheet (R16.1)